# Altium schematic sheet Thermistors.SchDoc
size A4; SheetNumber: 6; SheetTotal: 8
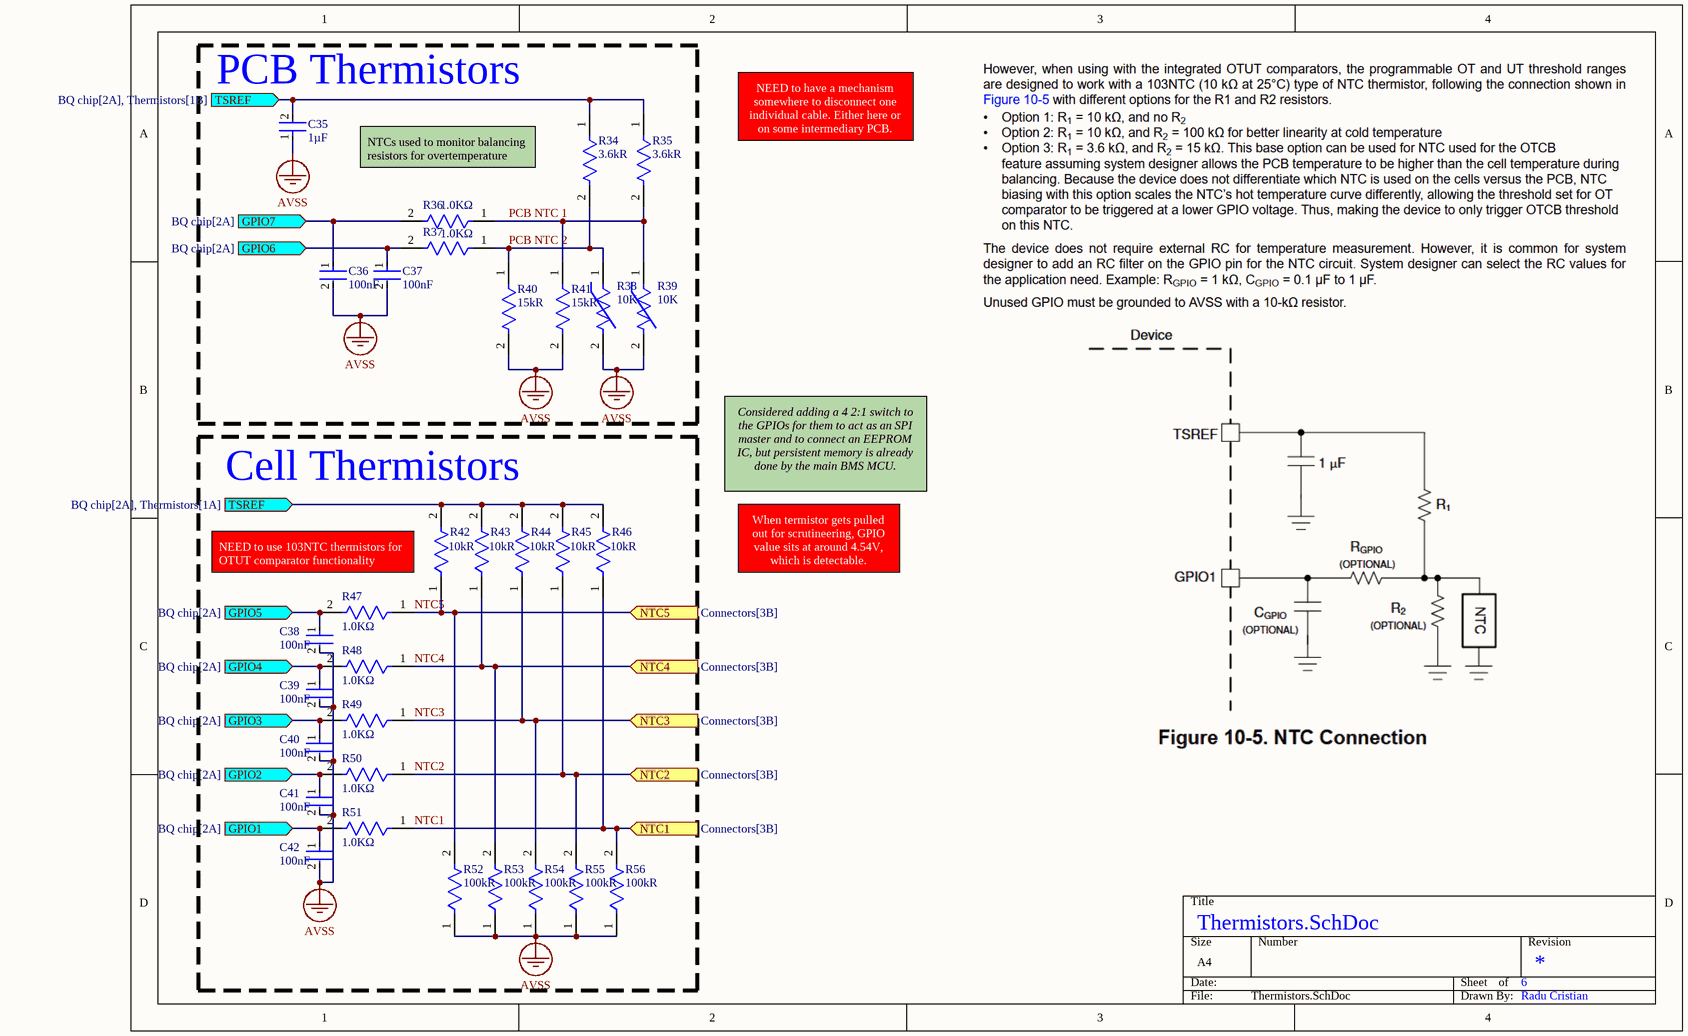
[diagram p0: Thermistors.SchDoc]

## Parts
C35  Capacitance: 1µF  [FP-VJ0603Y105KXJCW1BC-MFG]  (hidden comment: VJ0603Y105KXJCW1BC)
C36  Capacitance: 100nF  [FP-GRM188-0_1-e0_2_0_5-MFG]  (hidden comment: GRM188R72A104MA35D)
C37  Capacitance: 100nF  [FP-GRM188-0_1-e0_2_0_5-MFG]  (hidden comment: GRM188R72A104MA35D)
C38  Capacitance: 100nF  [FP-GRM188-0_1-e0_2_0_5-MFG]  (hidden comment: GRM188R72A104MA35D)
C39  Capacitance: 100nF  [FP-GRM188-0_1-e0_2_0_5-MFG]  (hidden comment: GRM188R72A104MA35D)
C40  Capacitance: 100nF  [FP-GRM188-0_1-e0_2_0_5-MFG]  (hidden comment: GRM188R72A104MA35D)
C41  Capacitance: 100nF  [FP-GRM188-0_1-e0_2_0_5-MFG]  (hidden comment: GRM188R72A104MA35D)
C42  Capacitance: 100nF  [FP-GRM188-0_1-e0_2_0_5-MFG]  (hidden comment: GRM188R72A104MA35D)
R34  Resistance: 3.6kR  [FP-AF0603-IPC_B]  (hidden comment: AF0603FR-073K6L)
R35  Resistance: 3.6kR  [FP-AF0603-IPC_B]  (hidden comment: AF0603FR-073K6L)
R36  Resistance: 1.0KΩ  [FP-CPF0603-MFG]  (hidden comment: CPF0603F1K0C1)
R37  Resistance: 1.0KΩ  [FP-CPF0603-MFG]  (hidden comment: CPF0603F1K0C1)
R38  Parameter 1: 10K  [FP-NC_18-0_15-IPC_B]  (hidden comment: NCG18XH103F0SRB)
R39  Parameter 1: 10K  [FP-NC_18-0_15-IPC_B]  (hidden comment: NCG18XH103F0SRB)
R40  Resistance: 15kR  [FP-RNCP0603-IPC_C]  (hidden comment: RNCP0603FTD15K0)
R41  Resistance: 15kR  [FP-RNCP0603-IPC_C]  (hidden comment: RNCP0603FTD15K0)
R42  Resistance: 10kR  [FP-MCT0603-IPC_C]  (hidden comment: MCT0603MC1002FP500)
R43  Resistance: 10kR  [FP-MCT0603-IPC_C]  (hidden comment: MCT0603MC1002FP500)
R44  Resistance: 10kR  [FP-MCT0603-IPC_C]  (hidden comment: MCT0603MC1002FP500)
R45  Resistance: 10kR  [FP-MCT0603-IPC_C]  (hidden comment: MCT0603MC1002FP500)
R46  Resistance: 10kR  [FP-MCT0603-IPC_C]  (hidden comment: MCT0603MC1002FP500)
R47  Resistance: 1.0KΩ  [FP-CPF0603-IPC_C]  (hidden comment: CPF0603F1K0C1)
R48  Resistance: 1.0KΩ  [FP-CPF0603-IPC_C]  (hidden comment: CPF0603F1K0C1)
R49  Resistance: 1.0KΩ  [FP-CPF0603-IPC_C]  (hidden comment: CPF0603F1K0C1)
R50  Resistance: 1.0KΩ  [FP-CPF0603-IPC_C]  (hidden comment: CPF0603F1K0C1)
R51  Resistance: 1.0KΩ  [FP-CPF0603-IPC_C]  (hidden comment: CPF0603F1K0C1)
R52  Resistance: 100kR  [FP-MCT0603-IPC_C]  (hidden comment: MCT0603MC1003FP500)
R53  Resistance: 100kR  [FP-MCT0603-IPC_C]  (hidden comment: MCT0603MC1003FP500)
R54  Resistance: 100kR  [FP-MCT0603-IPC_C]  (hidden comment: MCT0603MC1003FP500)
R55  Resistance: 100kR  [FP-MCT0603-IPC_C]  (hidden comment: MCT0603MC1003FP500)
R56  Resistance: 100kR  [FP-MCT0603-IPC_C]  (hidden comment: MCT0603MC1003FP500)

## Blocks framed on the sheet
PCB Thermistors: C35-C37 R34-R41
Cell Thermistors: C38-C42 R42-R56

## Ports
GPIO1 (in, see BQ chip[2A]), GPIO2 (in, see BQ chip[2A]), GPIO3 (in, see BQ chip[2A]), GPIO4 (in, see BQ chip[2A]), GPIO5 (in, see BQ chip[2A]), GPIO6 (in, see BQ chip[2A]), GPIO7 (in, see BQ chip[2A]), NTC1 (in, see Connectors[3B]), NTC2 (in, see Connectors[3B]), NTC3 (in, see Connectors[3B]), NTC4 (in, see Connectors[3B]), NTC5 (in, see Connectors[3B]), TSREF (in, see BQ chip[2A], Thermistors[1A]), TSREF (in, see BQ chip[2A], Thermistors[1B])

## Nets
AVSS: C35.1 C36.2 C37.2 C38.2 C39.2 C40.2 C41.2 C42.2 R38.2 R39.2 R40.2 R41.2 R52.1 R53.1 R54.1 R55.1 R56.1
GPIO1: C42.1 R51.2 ; port GPIO1
GPIO2: C41.1 R50.2 ; port GPIO2
GPIO3: C40.1 R49.2 ; port GPIO3
GPIO4: C39.1 R48.2 ; port GPIO4
GPIO5: C38.1 R47.2 ; port GPIO5
GPIO6: C37.1 R37.2 ; port GPIO6
GPIO7: C36.1 R36.2 ; port GPIO7
NTC1: R46.1 R51.1 R56.2 ; port NTC1
NTC2: R45.1 R50.1 R55.2 ; port NTC2
NTC3: R44.1 R49.1 R54.2 ; port NTC3
NTC4: R43.1 R48.1 R53.2 ; port NTC4
NTC5: R42.1 R47.1 R52.2 ; port NTC5
PCB NTC 1: R35.2 R36.1 R39.1 R41.1
PCB NTC 2: R34.2 R37.1 R38.1 R40.1
TSREF: C35.2 R34.1 R35.1 R42.2 R43.2 R44.2 R45.2 R46.2 ; port TSREF

## Notes on the sheet
- NTCs used to monitor balancing resistors for overtemperature
- NEED to have a mechanism somewhere to disconnect one individual cable. Either here or on some intermediary PCB.
- Considered adding a 4 2:1 switch to the GPIOs for them to act as an SPI master and to connect an EEPROM IC, but persistent memory is already done by the main BMS MCU.
- NEED to use 103NTC thermistors for OTUT comparator functionality
- When termistor gets pulled out for scrutineering, GPIO value sits at around 4.54V, which is detectable.
- Radu Cristian

## Library data of the parts
C35 = CMP-00030-45106517-1: VJ0603Y105KXJCW1BC Multilayer Ceramic Capacitor, 1 uF, 16 V, ± 10%, X7R, 0603 [1608 Metric]; Voltage Rating: 16V; Dielectric Material: Tantalum; Radiation Hardening: No; RoHS: Compliant; Packaging: Tape and Reel; Material: Ceramic; Height: 950µm; Voltage Rating (DC): 16V; Tolerance: 10%; NexarPartId: 45106517; Min Operating Temperature: -55°C; Depth: 800µm; Case/Package: 0603; Length: 1.6mm; Max Operating Temperature: 125°C; Mount: Surface Mount; Lead Free: Lead Free; Dielectric: X7R
C36-C42 = CMP-06035-009454-1: Chip Multilayer Ceramic Capacitors for General Purpose, 0603, 0.10uF, X7R, 15%, 20%, 100V; Voltage Rating (DC): 100V; Dielectric: X7R; Width: 800um; Tolerance: 20%; Thickness: 800um; Length: 1.6mm
R34 R35 = CMP-03412-047053-1: Anti-Sulfurated Chip Resistors Automotive Grade 3.6kΩ 1% 100ppm/°C 0603; Max Power Dissipation: 100mW; Packaging: Tape and Reel; Series: AF; Case/Package: 0603; Temperature Coefficient: 100ppm/°C; Max Operating Temperature: 155°C; Height: 0.022inch; Width: 0.031inch; Features: Moisture Resistant; RoHS Compliant: Yes; Min Operating Temperature: -55°C; Length: 0.063inch; Resistor Type: Thick Film; Number of Terminations: 2; Tolerance: 1%
R36 R37 R47-R51 = CMP-03211-002621-1: RES SMD 1.0KΩ 1% 1/16W 0603; Manufacturer: TE Connectivity; Power Rating: 0.063W; Voltage Rating: 50V; Temperature Coefficient: 50ppm/°C; Octopart: https://octopart.com/cpf0603f1k0c1-te+connectivity-42013134; packaging: 1k Reel; Category: Res; Device Class L3: Chip SMD Resistors; octopart_url: https://octopart.com/cpf0603f1k0c1-te+connectivity-42013134; Value: 1.0KΩ; Temperature: -55°C to +155°C; Composition: Thin Film; ComponentLink2URL: https://www.te.com/commerce/DocumentDelivery/DDEController?Action=showdoc&DocId=Data+Sheet%7F1773200%7FM%7Fpdf%7FEnglish%7FENG_DS_1773200_M.pdf%7F3-1676481-2; Tolerance: 1%; Automotive: No; Lead Free: Yes; Height: 0.55mm; Device Class L1: Passive Components; Device Class L2: Resistors; Ipc Land Pattern Name: RESC15580X45; Series: CPF; ComponentLink2Description: Datasheet; RoHS: TRUE; Package: CPF0603; Manufacturer Part Number: CPF0603F1K0C1; Temperature Range Low: -55°C; Temperature Range High: +155°C
R38 R39 = CMP-06022-000566-1: NTC Thermistor 10kΩ 1% SMD  0201 (0603 Metric); Min Operating Temperature: -55°C; Case/Package: 0603; Tolerance: 1%; Max Operating Temperature: 150°C; Number of Pins: 2; Length: 1.6mm; Packaging: Tape and Reel; Depth: 0.8mm
R40 R41 = CMP-26527-006590-1: 15kΩ ±1% 0.125W 0603 High Power Anti-Sulfur Thin Film Chip Resistor; Max Power Dissipation: 125mW; Temperature Coefficient: 100ppm/°C; Tolerance: 1%; Case Code (Metric): 1608; Features: Moisture Resistant; Case/Package: 0603; Resistor Type: Thin Film; Height: 0.02inch; Length: 0.059inch; Max Operating Temperature: 155°C; Packaging: Tape and Reel; Width: 0.031inch; Number of Terminations: 2; Min Operating Temperature: -55°C; Case Code (Imperial): 0603; Mount: Surface Mount; Lead Free: Lead Free; RoHS Compliant: Yes; Series: RNCP
R42-R46 = CMP-02407-001346-1: RES SMD 100 OHM 1% 1/8W 0603; Voltage Rating: 75V; Power Rating: 125mW; Length: 1.6mm; Case Code (Metric): 1608; Composition: Thin Film; Height: 0.45mm; Weight: 7.1E-05oz; Min Operating Temperature: -55°C; Packaging: Tape and Reel; Width: 0.8mm; Case/Package: 0603; Tolerance: 1%; Termination: SMD/SMT; Package Quantity: 5000; Case Code (Imperial): 0603; Max Operating Temperature: 155°C
R52-R56 = CMP-02407-008119-1: RES SMD 100 OHM 1% 1/8W 0603; Voltage Rating: 75V; Power Rating: 125mW; Length: 1.55mm; Packaging: Tape and Reel; Width: 0.85mm; Case Code (Metric): 1608; Weight: 6.7E-05oz; Tolerance: 1%; Height: 0.45mm; Case Code (Imperial): 0603; Max Operating Temperature: 175°C; Case/Package: 0603; Min Operating Temperature: -55°C; Composition: Thin Film